# Altium schematic sheet POWER.SchDoc: POWER 原理图
size A4; Address1: 原理图 吴国才; Address2: PCB 吴国才; DocumentNumber: 2; Revision: V1.0; SheetNumber: 2; SheetTotal: 3
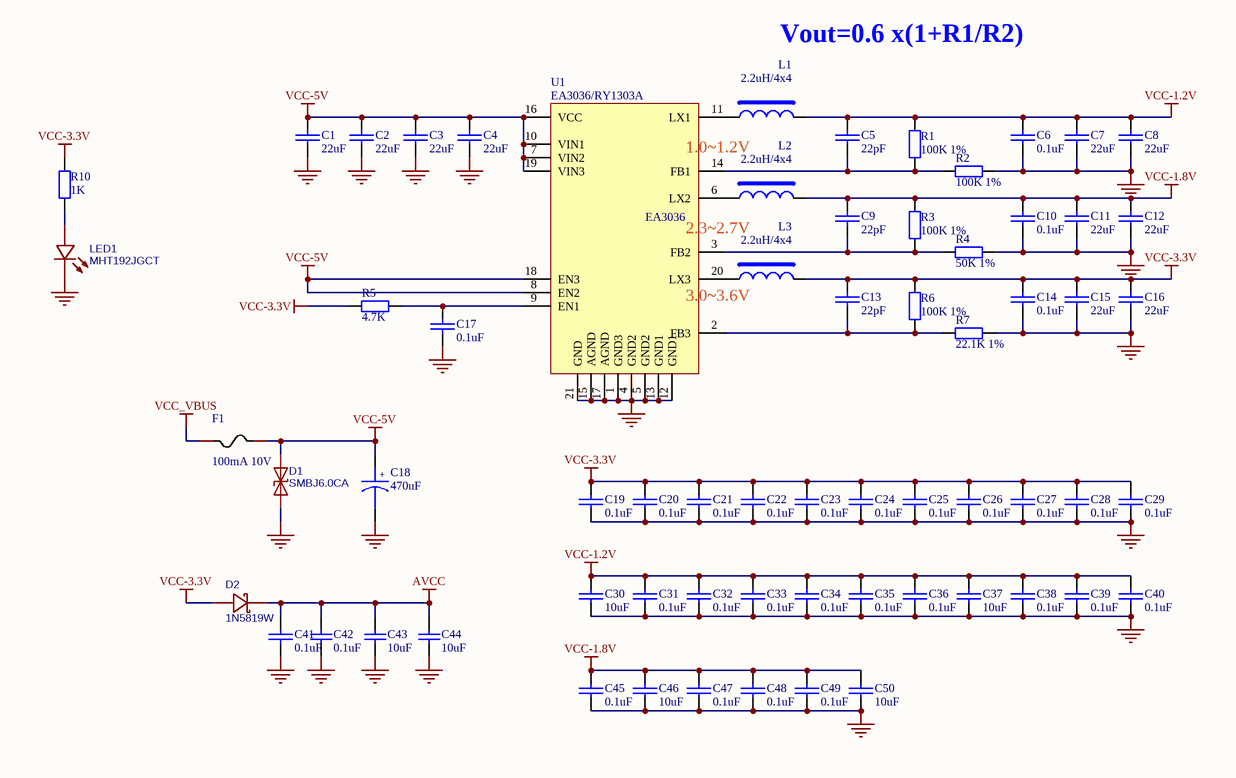
[diagram p0: POWER.SchDoc]

## Parts
C1  22uF  [0805_C]
C2  22uF  [0805_C]
C3  22uF  [0805_C]
C4  22uF  [0805_C]
C5  22pF  [0402_C]
C6  0.1uF  [0402_C]
C7  22uF  [0805_C]
C8  22uF  [0805_C]
C9  22pF  [0402_C]
C10  0.1uF  [0402_C]
C11  22uF  [0805_C]
C12  22uF  [0805_C]
C13  22pF  [0402_C]
C14  0.1uF  [0402_C]
C15  22uF  [0805_C]
C16  22uF  [0805_C]
C17  0.1uF  [0402_C]
C18  470uF  [SEC6.3]
C19  0.1uF  [0402_C]
C20  0.1uF  [0402_C]
C21  0.1uF  [0402_C]
C22  0.1uF  [0402_C]
C23  0.1uF  [0402_C]
C24  0.1uF  [0402_C]
C25  0.1uF  [0402_C]
C26  0.1uF  [0402_C]
C27  0.1uF  [0402_C]
C28  0.1uF  [0402_C]
C29  0.1uF  [0402_C]
C30  10uF  [0603_C]
C31  0.1uF  [0402_C]
C32  0.1uF  [0402_C]
C33  0.1uF  [0402_C]
C34  0.1uF  [0402_C]
C35  0.1uF  [0402_C]
C36  0.1uF  [0402_C]
C37  10uF  [0603_C]
C38  0.1uF  [0402_C]
C39  0.1uF  [0402_C]
C40  0.1uF  [0402_C]
C41  0.1uF  [0402_C]
C42  0.1uF  [0402_C]
C43  10uF  [0603_C]
C44  10uF  [0603_C]
C45  0.1uF  [0402_C]
C46  10uF  [0603_C]
C47  0.1uF  [0402_C]
C48  0.1uF  [0402_C]
C49  0.1uF  [0402_C]
C50  10uF  [0603_C]
D1  SMBJ6.0CA  [SMB(DO-214AA)]
D2  1N5819W  [SOD-123]
F1  100mA 10V  [1206_F]
L1  2.2uH/4x4  [SMD,4x4x2mm]
L2  2.2uH/4x4  [SMD,4x4x2mm]
L3  2.2uH/4x4  [SMD,4x4x2mm]
LED1  MHT192JGCT  [LED0603]
R1  100K 1%  [0402_R]
R2  100K 1%  [0402_R]
R3  100K 1%  [0402_R]
R4  50K 1%  [0402_R]
R5  4.7K  [0402_R]
R6  100K 1%  [0402_R]
R7  22.1K 1%  [0402_R]
R10  1K  [0402_R]
U1  EA3036/RY1303A  [QFN3x3-20]

## Nets
AVCC: C41.2 C42.1 C43.2 C44.2 D2.1(C)
GND: C1.2 C2.2 C3.2 C4.2 C6.1 C7.2 C8.2 C10.1 C11.2 C12.2 C14.1 C15.2 C16.2 C17.1 C18.2 C19.1 C20.1 C21.1 C22.1 C23.1 C24.1 C25.1 C26.1 C27.1 C28.1 C29.1 C30.1 C31.1 C32.1 C33.1 C34.1 C35.1 C36.1 C37.1 C38.1 C39.1 C40.1 C41.1 C42.2 C43.1 C44.1 C45.1 C46.1 C47.1 C48.1 C49.1 C50.1 D1.2(A1) LED1.1(-) R2.2 R4.2 R7.2 U1.1(GND3) U1.4(GND2) U1.5(GND2) U1.12(GND1) U1.13(GND1) U1.15(AGND) U1.17(AGND) U1.21(GND)
VCC-1.2V: C5.2 C6.2 C7.1 C8.1 C30.2 C31.2 C32.2 C33.2 C34.2 C35.2 C36.2 C37.2 C38.2 C39.2 C40.2 L1.1 R1.2
VCC-1.8V: C9.2 C10.2 C11.1 C12.1 C45.2 C46.2 C47.2 C48.2 C49.2 C50.2 L2.1 R3.2
VCC-3.3V: C13.2 C14.2 C15.1 C16.1 C19.2 C20.2 C21.2 C22.2 C23.2 C24.2 C25.2 C26.2 C27.2 C28.2 C29.2 D2.2(A) L3.1 R5.1 R6.2 R10.2
VCC-5V: C1.1 C2.1 C3.1 C4.1 C18.1 D1.1(A2) F1.1 U1.7(VIN2) U1.8(EN2) U1.10(VIN1) U1.16(VCC) U1.18(EN3) U1.19(VIN3)
VCC_VBUS: F1.2
NetC5_1: C5.1 R1.1 R2.1 U1.14(FB1)
NetC9_1: C9.1 R3.1 R4.1 U1.3(FB2)
NetC13_1: C13.1 R6.1 R7.1 U1.2(FB3)
NetC17_2: C17.2 R5.2 U1.9(EN1)
NetL1_2: L1.2 U1.11(LX1)
NetL2_2: L2.2 U1.6(LX2)
NetL3_2: L3.2 U1.20(LX3)
NetLED1_2: LED1.2(+) R10.1

## Notes on the sheet
- Vout=0.6 x(1+R1/R2)
- (near U1) 1.0~1.2V
- (near U1) 2.3~2.7V
- (near U1) 3.0~3.6V
- Title
- Size:
- Date:
- A4
- Number:
- Time:
- Revision:
- Sheet
- of
- File:
- (in symbol CAPACITOR POL) +

## Library data of the parts
C1-C17 C19-C41 C45-C50 = CAP: 贴片电容; value: 贴片电容/105 ±10% 50V X7R 编带 封装规格：0603
C18 = CAPACITOR POL: 贴片电解电容; value: 贴片电解电容/220uF 16V ±20% 编带  封装规格：6.3*7.7
C42-C44 = 036960: 贴片电容; 存货编码: 036960; 产品型名: CC0603KRX7R9BB104(C0603-104K/50V); 品牌: YAGEO; 封装: 0603; 品名: 电容器
D1 = SMBJ6.0CA_C211762: BOM_Manufacturer: Yangzhou Yangjie Elec Tech; Contributor: LCSC; BOM_Supplier: LCSC; BOM_Supplier Part: C211762; BOM_Manufacturer Part: SMBJ6.0CA; BOM_JLCPCB Part Class: Extended Part; spicePre: D; spiceSymbolName: SMBJ6.0CA_C211762
D2 = 1N5819W_C727115: C727115; BOM_Manufacturer: TWGMC; Contributor: LCSC; BOM_Supplier: LCSC; BOM_Supplier Part: C727115; BOM_Manufacturer Part: 1N5819W; BOM_JLCPCB Part Class: Extended Part; spicePre: D; spiceSymbolName: 1N5819W_C727115
F1 = nSMD025: 贴片自恢复保险丝
L1-L3 = ind1: 贴片功率电感; Isat: 3.3A; DC Resistor: 0.04ohm; Resonace frequency: 38M; Irms: 2.4A; Tolerance: 20%; Priority: A; Created by: YTL
LED1 = MHT192JGCT: LED贴片0603高亮黄绿色光,C473820; BOM_Manufacturer: MEIHUA; Contributor: LCSC; BOM_Supplier: LCSC; BOM_Supplier Part: C473820; BOM_Manufacturer Part: MHT192JGCT; BOM_JLCPCB Part Class: Extended Part; spicePre: L; spiceSymbolName: MHT192JGCT
R1-R7 R10 = Res2: 贴片电阻; value: 贴片电阻/10KΩ ±5% 编带 封装规格：0603
U1 = EA3036